# EAGLE design arduinizer (EAGLE 6.4)
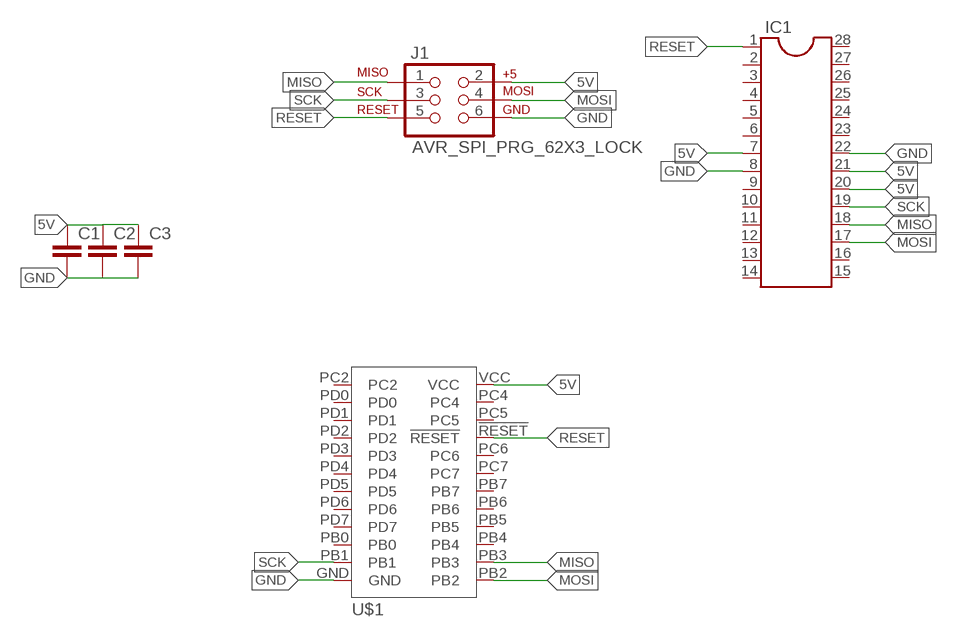
[diagram p0: schematic, sheet 1]

## Parts
C1  C-EU025-025X050  [C025-025X050]
C2  C-EU025-025X050  [C025-025X050]
C3  C-EU025-025X050  [C025-025X050]
IC1  DIL28  [DIL28-6]
J1  AVR_SPI_PRG_62X3_LOCK  [2X3_LOCK]
U$1  MINIMUSBIGPADS  [MINIMUSBIGPADS]

## Nets
5V: C1.1 C2.1 C3.1 IC1.7 IC1.20 IC1.21 J1.2 U$1.VCC
GND: C1.2 C2.2 C3.2 IC1.8 IC1.22 J1.6 U$1.GND
MISO: IC1.18 J1.1 U$1.PB3
MOSI: IC1.17 J1.4 U$1.PB2
RESET: IC1.1 J1.5 U$1.!RESET
SCK: IC1.19 J1.3 U$1.PB1
Unconnected: IC1.2 IC1.3 IC1.4 IC1.5 IC1.6 IC1.9 IC1.10 IC1.11 IC1.12 IC1.13 IC1.14 IC1.15 IC1.16 IC1.23 IC1.24 IC1.25 IC1.26 IC1.27 IC1.28 U$1.PB0 U$1.PB4 U$1.PB5 U$1.PB6 U$1.PB7 U$1.PC2 U$1.PC4 U$1.PC5 U$1.PC6 U$1.PC7 U$1.PD0 U$1.PD1 U$1.PD2 U$1.PD3 U$1.PD4 U$1.PD5 U$1.PD6 U$1.PD7

## Library data of the parts
C1-C3 = rcl:C-EU: CAPACITOR, European symbol
IC1 = ic-package:DIL28: Dual In Line
J1 = AVR Header:AVR_SPI_PRG_6: AVR ISP 6 Pin This is the reduced ISP connector for AVR programming. Common on Arduino. This footprint will take up less PCB space and can be used with a 10-pin to 6-pin adapter such as SKU: BOB-08508
U$1 = minimus:MINIMUS

## Board
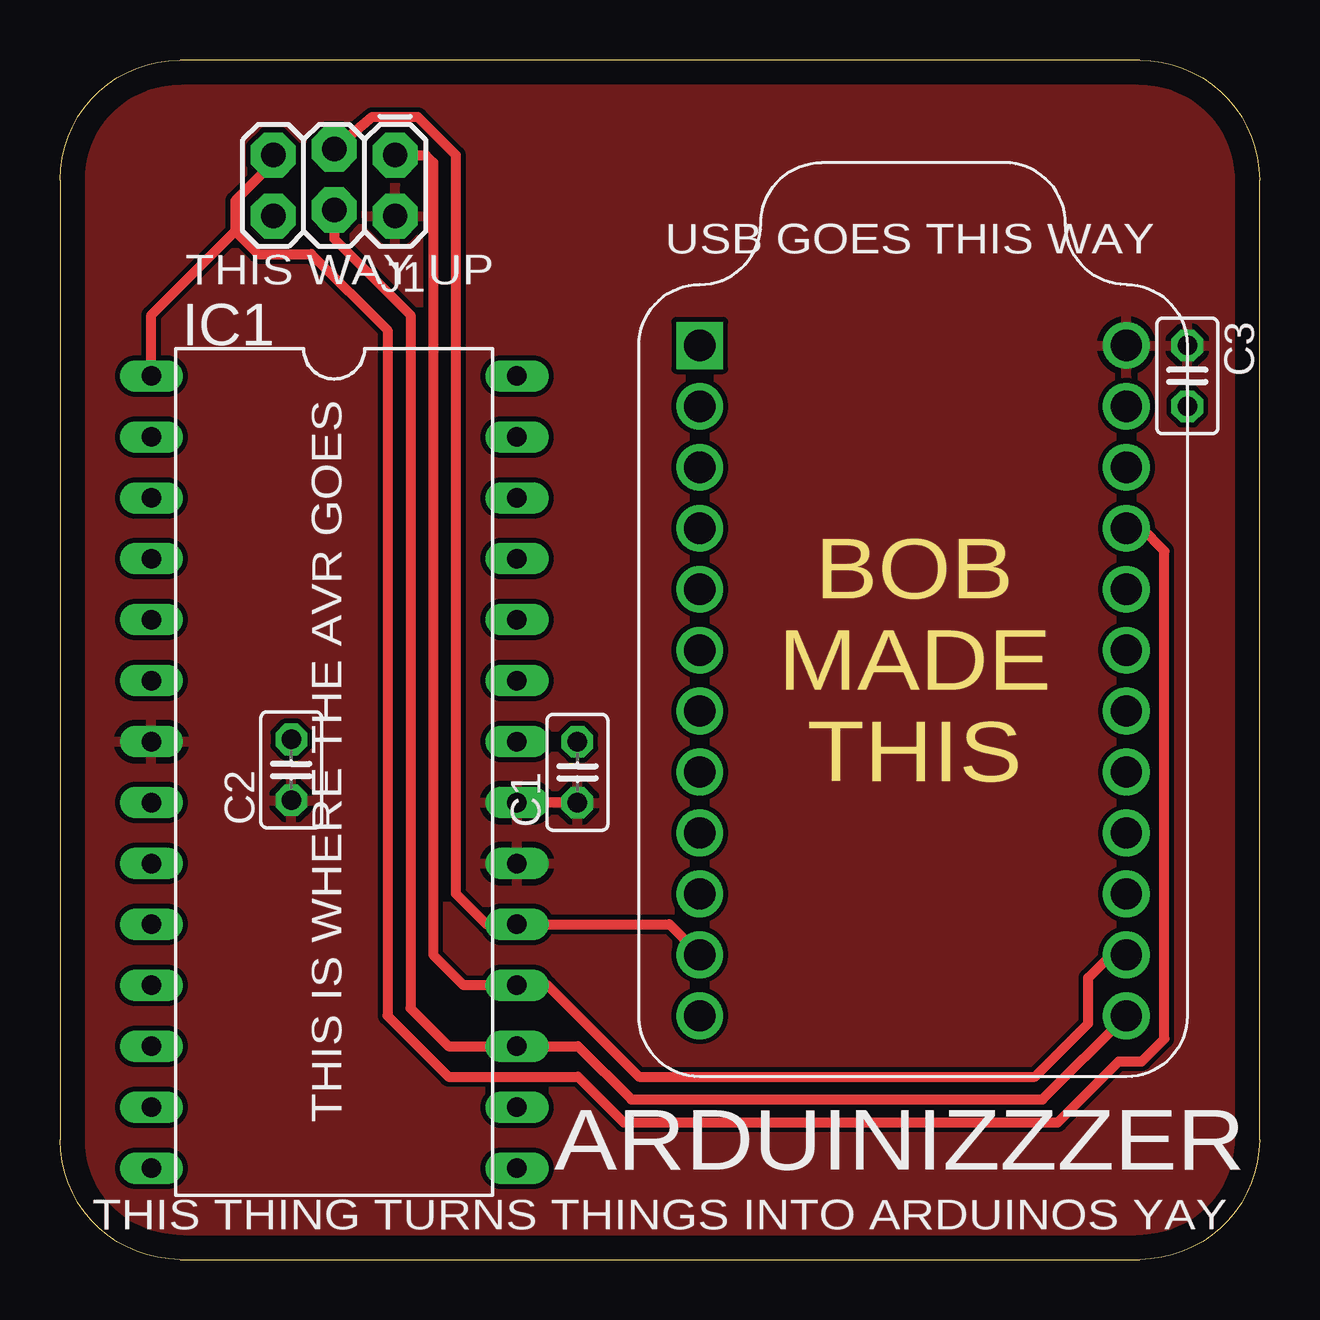
[diagram p1: board, top side]
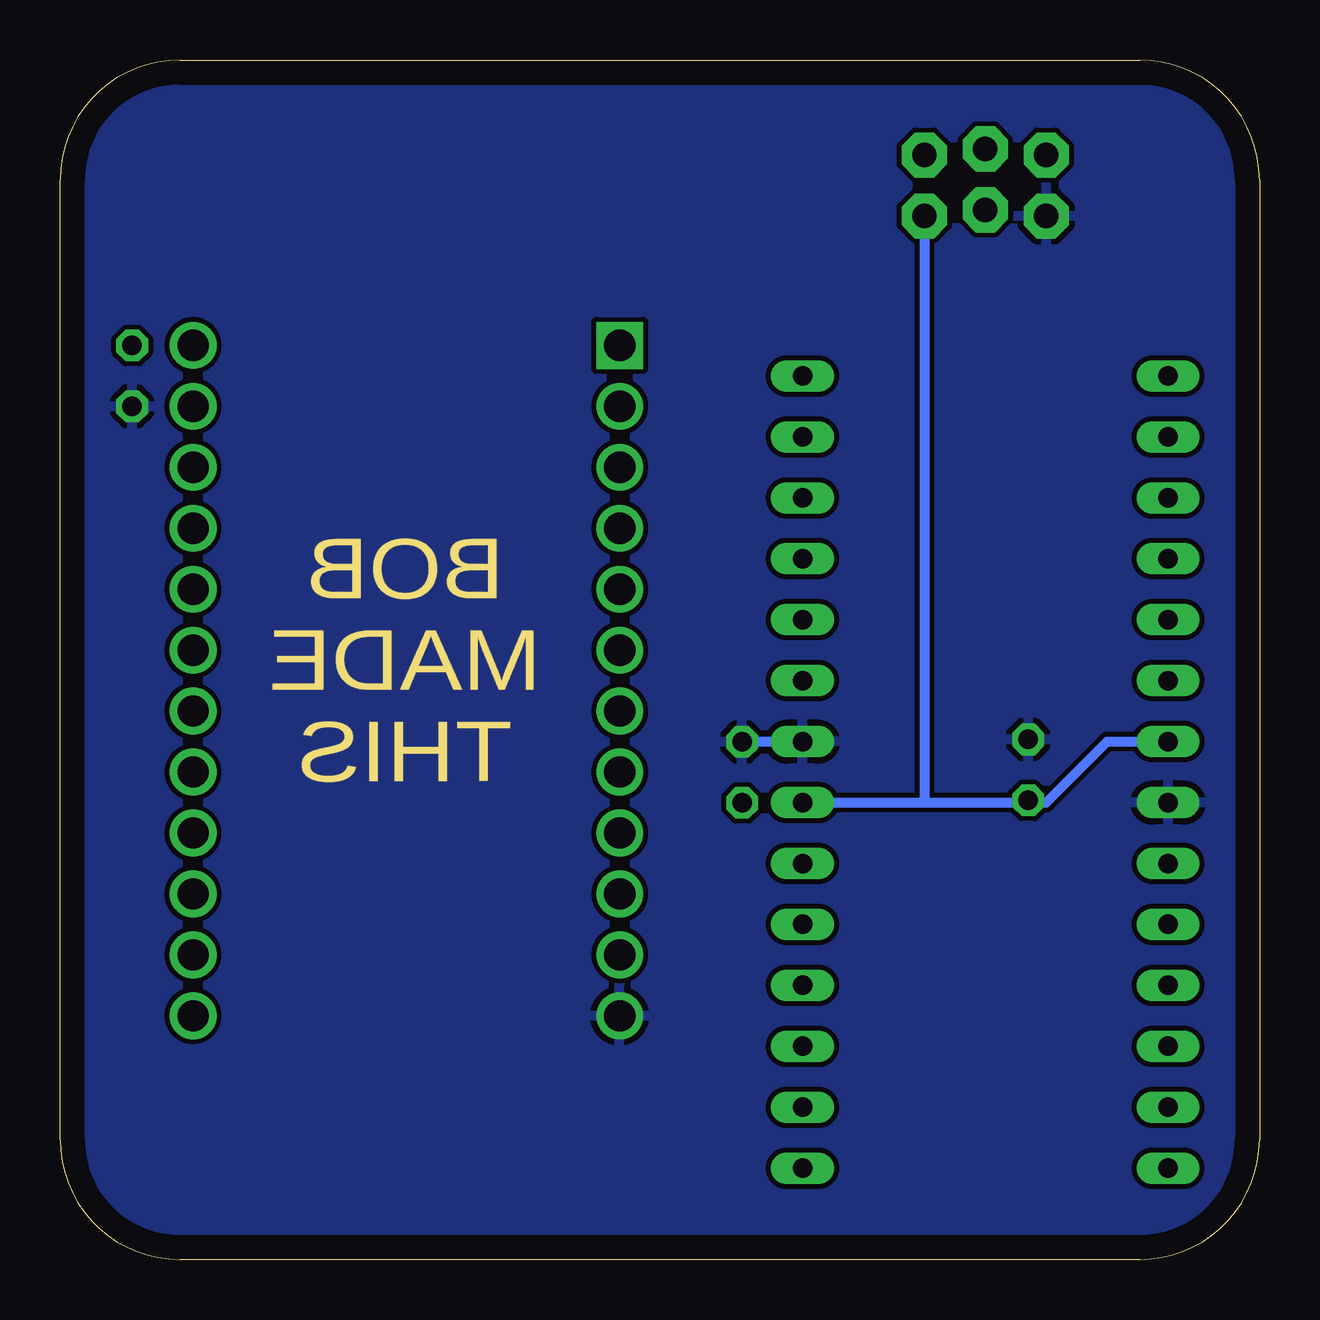
[diagram p2: board, bottom side, seen from below]

Size 50 x 50 mm. Coordinates in mm from the lower left corner, seen from the top.
Outline: 5,0 45,0 arc90 50,5 50,45 arc90 45,50 5,50 arc90 0,45 0,5 arc90 5,0
Copper layers (1*16): Top 0.035mm / dielectric 1.5mm / Bottom 0.035mm
Design rules "default": minimum track width 10mil, minimum drill 24mil, track to track 8mil, track to pad 8mil, pad to pad 8mil, via to via 8mil, smd to smd 8mil, copper to edge 40mil, drill to drill 8mil, minimum pad ring 10mil, minimum via ring 8mil, stop-mask expansion 4mil, vias tented up to drill 0mil, thermal gap 10mil

### Footprints (pad centres in the part's own frame; a part is rotated, then mirrored left to right if it is on the bottom)
C025-025X050 = drill 0.813 octagon: 1 -1.27,0; 2 1.27,0
DIL28-6 = drill 0.813 long: 1 -16.51,-7.62; 2 -13.97,-7.62; 3 -11.43,-7.62; 4 -8.89,-7.62; 5 -6.35,-7.62; 6 -3.81,-7.62; 7 -1.27,-7.62; 8 1.27,-7.62; 9 3.81,-7.62; 10 6.35,-7.62; 11 8.89,-7.62; 12 11.43,-7.62; 13 13.97,-7.62; 14 16.51,-7.62; 15 16.51,7.62; 16 13.97,7.62; 17 11.43,7.62; 18 8.89,7.62; 19 6.35,7.62; 20 3.81,7.62; 21 1.27,7.62; 22 -1.27,7.62; 23 -3.81,7.62; 24 -6.35,7.62; 25 -8.89,7.62; 26 -11.43,7.62; 27 -13.97,7.62; 28 -16.51,7.62
2X3_LOCK = drill 1.016 pad 1.88 octagon: 1 0,0; 2 0,2.54; 3 2.54,-0.254; 4 2.54,2.286; 5 5.08,0; 6 5.08,2.54
MINIMUSBIGPADS = drill 1.3: !RESET 17.78,-7.62; GND 0,-27.94; PB0 0,-22.86; PB1 0,-25.4; PB2 17.78,-27.94; PB3 17.78,-25.4; PB4 17.78,-22.86; PB5 17.78,-20.32; PB6 17.78,-17.78; PB7 17.78,-15.24; PC4 17.78,-2.54; PC5 17.78,-5.08; PC6 17.78,-10.16; PC7 17.78,-12.7; PD0 0,-2.54; PD1 0,-5.08; PD2 0,-7.62; PD3 0,-10.16; PD4 0,-12.7; PD5 0,-15.24; PD6 0,-17.78; PD7 0,-20.32; VCC 17.78,0 | drill 1.3 square: PC2 0,0

### Placement (x,y rotation side)
C1  21.57,20.31 90 top
C2  9.64,20.41 90 top
C3  46.99,36.83 270 top
IC1  11.43,20.32 270 top
J1  13.97,46.04 180 top
U$1  26.67,38.1 0 top

### Tracks (layer width: path | path; a pad name or v marks a point on that pad's centre or on a via)
5V
  Top 0.406: 21.59,19.05 IC1.21
  Bottom 0.406: IC1.7 6.35,21.59 8.89,19.05 13.97,19.05 | IC1.21 13.97,19.05 | J1.2 13.97,19.05
  pour Top: -1.27,52.07 52.07,52.07 52.07,-2.54 -1.27,-2.54
GND
  Bottom 0.406: 21.59,21.59 IC1.22
  pour Bottom: -2.54,50.8 53.34,50.8 53.34,-3.81 -2.54,-3.81
MISO
  Top 0.406: U$1.PB3 43.81,12.7 42.86,11.75 42.86,9.84 40.64,7.62 24.13,7.62 20.32,11.43 IC1.18 16.83,11.43 15.56,12.7 15.56,45.72 15.24,46.04 J1.1
MOSI
  Top 0.406: U$1.PB2 40.96,6.67 23.81,6.67 21.59,8.89 IC1.17 16.19,8.89 14.61,10.48 14.61,39.37 11.43,42.55 J1.4
RESET
  Top 0.406: J1.5 8.89,45.72 7.3,44.13 7.3,42.86 | 7.3,42.86 8.26,41.91 10.48,41.91 13.65,38.73 13.65,10.16 16.19,7.62 21.59,7.62 23.5,5.71 41.59,5.71 44.13,8.26 45.09,8.26 46.04,9.21 46.04,29.53 45.09,30.48 U$1.!RESET | IC1.1 3.81,39.37 7.3,42.86
SCK
  Top 0.406: J1.3 13.02,47.62 14.92,47.62 16.51,46.04 16.51,15.24 17.78,13.97 IC1.19 25.4,13.97 U$1.PB1

### Text on the board
Dimension: BOB / MADE / THIS
_tsilk: USB GOES THIS WAY | THIS WAY UP | THIS IS WHERE THE AVR GOES | ARDUINIZZZER | THIS THING TURNS THINGS INTO ARDUINOS YAY